# EAGLE design MagicDice_v1.2 (EAGLE 7.2.0)
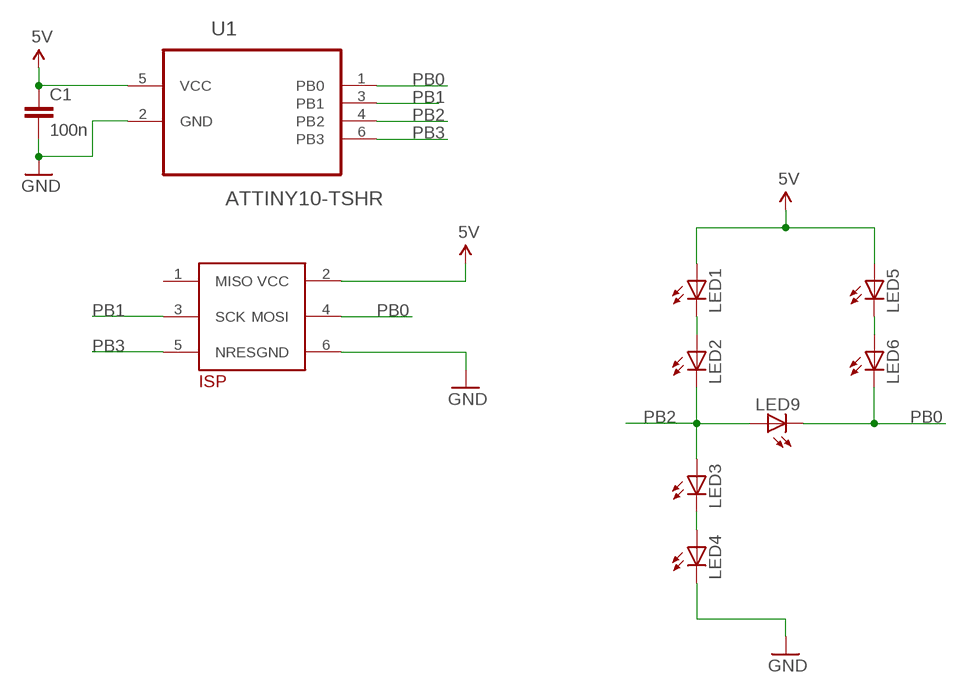
[diagram p0: schematic, sheet 1]

## Parts
C1  100n  CAP0805  [0805]
LED1  LED0603  [LED-0603]
LED2  LED0603  [LED-0603]
LED3  LED0603  [LED-0603]
LED4  LED0603  [LED-0603]
LED5  LED0603  [LED-0603]
LED6  LED0603  [LED-0603]
LED9  LED0603  [LED-0603]
U1  ATTINY10-TSHR  [SOT95P280X145-6N]
U$1  TB_ISPEDGE_2X3  [ISP_EDGE2X3]

## Nets
5V [Power]: C1.1 LED1.A LED5.A U1.5(VCC) U$1.2(VCC)
GND [Power]: C1.2 LED4.C U1.2(GND) U$1.6(GND)
N$1: LED1.C LED2.A
N$2: LED5.C LED6.A
N$6: LED3.C LED4.A
PB0: LED6.C LED9.C U1.1(PB0) U$1.4(MOSI)
PB1: U1.3(PB1) U$1.3(SCK)
PB2: LED2.C LED3.A LED9.A U1.4(PB2)
PB3: U1.6(PB3) U$1.5(NRES)
Unconnected: U$1.1(MISO)

## Library data of the parts
C1 = SparkFun-Capacitors:CAP: Capacitor Standard 0603 ceramic capacitor, and 0.1" leaded capacitor.
LED1-LED6 LED9 = SparkFun-LED:LED: LEDs Standard schematic elements and footprints for 5mm, 3mm, 1206, and 0603 sized LEDs. 5mm - Spark Fun Electronics SKU : COM-00529 (and others)
U1 = Atmel_By_element14_Batch_1:ATTINY10-TSHR: 8-bit Microcontroller with In-System Programmable Flash; MPN: ATTINY10-TSHR; OC_FARNELL: 1748538; OC_NEWARK: 26R5645; PACKAGE: SOT-23-6; SUPPLIER: Atmel
U$1 = tb_custom:TB_ISPEDGE_2X3: AVR-ISP connector an Platinenrand

## Board
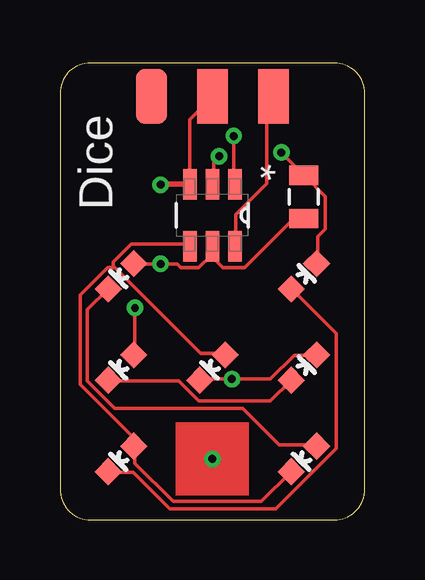
[diagram p1: board, top side]
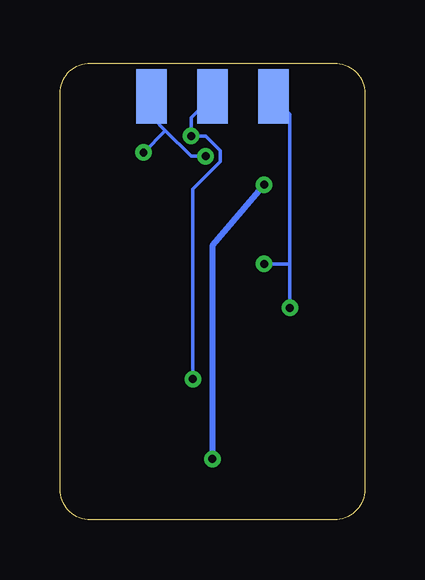
[diagram p2: board, bottom side, seen from below]

Size 12.7 x 19.05 mm. Coordinates in mm from the lower left corner, seen from the top.
Outline: 0,17.78 0,1.27 arc90 1.27,0 11.43,0 arc90 12.7,1.27 12.7,17.78 arc90 11.43,19.05 1.27,19.05 arc90 0,17.78
Copper layers (1*16): Top 0.0356mm / dielectric 1.5011mm / Bottom 0.0356mm
Design rules "LaenPCBOrder": minimum track width 6mil, minimum drill 13mil, track to track 6mil, track to pad 6mil, pad to pad 6mil, via to via 6mil, smd to smd 6mil, copper to edge 15mil, drill to drill 6mil, minimum pad ring 7mil, minimum via ring 7mil, stop-mask expansion 4mil, vias tented up to drill 0mil, thermal gap 10mil

### Footprints (pad centres in the part's own frame; a part is rotated, then mirrored left to right if it is on the bottom)
0805 = smd 0.8 x 1.2: 1 -0.9,0; 2 0.9,0
LED-0603 = smd 0.8 x 0.8: A 0,-0.75; C 0,0.75
SOT95P280X145-6N = smd 1.27 x 0.559: 1 -1.295,0.94; 2 -1.295,0; 3 -1.295,-0.94; 4 1.295,-0.94; 5 1.295,0; 6 1.295,0.94
ISP_EDGE2X3 = smd 2.286 x 1.27: 1 -0.127,2.54; 3 -0.127,0; 5 -0.127,-2.54 | smd 2.286 x 1.27 bottom: 2 -0.127,2.54; 4 -0.127,0; 6 -0.127,-2.54

### Placement (x,y rotation side)
C1  10.16,13.46 90 top
LED1  2.54,10.16 135 top
LED2  10.16,2.54 135 top
LED3  2.54,2.54 135 top
LED4  10.16,10.16 315 top
LED5  2.54,6.35 135 top
LED6  10.16,6.35 315 top
LED9  6.35,6.35 135 top
U1  6.35,12.7 270 top
U$1  6.35,17.78 90 top

### Tracks (layer width: path | path; a pad name or v marks a point on that pad's centre or on a via)
5V  (via drill 0.33)
  Top 0.152: LED1.A 3.12,10.67 v4.19,10.67 4.88,10.67 5.03,10.52 5.79,10.52 6.33,11.05 6.33,11.35 U1.5 6.33,10.97 6.78,10.52 7.7,10.52 9.68,12.5 10.13,12.5 C1.1 | v3.12,8.84 3.12,6.93 LED5.A
  Bottom 0.152: 3.12,10.67 3.12,16.92 3.81,17.6 U$1.2 | 3.12,10.67 v3.12,8.84 | 3.12,10.67 v4.19,10.67
GND  (via drill 0.33)
  Top 0.152: v6.63,15.16 6.4,14.94 6.4,14.02 U1.2 | v9.22,15.32 10.13,14.4 C1.2 10.21,14.33 11.05,13.49 11.05,12.12 10.74,11.81 10.74,10.74 LED4.C
  Bottom 0.152: v6.63,15.16 7.24,15.16 8.31,16.23 | 8.31,16.23 8.84,16.76 8.84,17.6 U$1.6 | 8.31,16.23 v9.22,15.32
N$1
  Top 0.152: LED1.C 1.14,8.76 1.14,5.79 2.29,4.65 7.62,4.65 9.14,3.12 10.67,3.12 LED2.A
N$2
  Top 0.152: 2.06,5.79 LED5.C 2.13,5.79 4.95,5.79 5.79,4.95 8.76,4.95 LED6.A
N$6
  Top 0.152: LED3.C 2.06,1.98 3.05,1.98 4.57,0.46 8.99,0.46 11.51,2.97 11.51,7.77 9.68,9.6 LED4.A
PB0  (via drill 0.33)
  Top 0.152: LED9.C 5.87,5.87 v7.16,5.87 8.76,5.87 9.75,6.86 10.67,6.86 LED6.C | v7.24,16 7.24,14.02 U1.1
  Bottom 0.152: U$1.4 7.24,16.76 v7.24,16 6.63,16 6.02,15.39 6.02,14.94 7.16,13.79 v7.16,5.87
PB1  (via drill 0.33, 0.33 pad 0.61)
  Top 0.152: U1.3 5.41,16.69 6.33,17.6 U$1.3
  Top 0.254: U1.3 v4.19,13.97
  Bottom 0.254: v4.19,13.97 6.35,11.43 v6.35,2.54
PB2
  Top 0.152: LED2.C 8.38,0.76 4.72,0.76 3.12,2.36 3.12,3.05 LED3.A 3.05,3.12 3.05,3.43 0.84,5.64 0.84,9.37 1.98,10.52 2.21,10.52 2.25,10.55 | 2.25,10.55 2.21,10.59 2.21,10.74 2.97,11.51 5.33,11.51 5.41,11.43 U1.4 | 2.25,10.55 5.87,6.93 6.86,6.93 LED9.A
PB3
  Top 0.152: U$1.5 8.61,17.37 8.61,14.02 7.32,12.72 7.32,11.43 U1.6
(copper drawn outside any net)
  shapes: Top area x1

### Text on the board
tPlace: Dice